# EAGLE schematic W25N01GVZ (EAGLE 7.5.0)
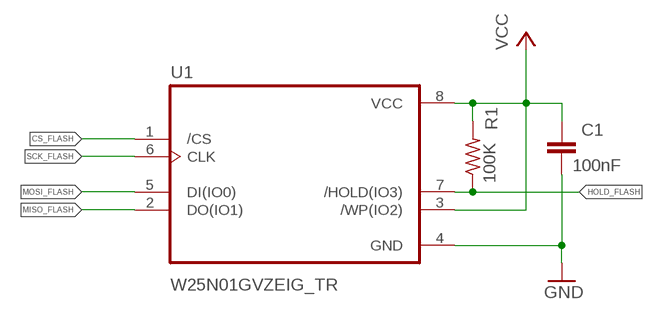
[diagram p0: schematic, sheet 1]

## Parts
C1  100nF  C-EUC0603  [C0603]
R1  100K  R-US_R0603  [R0603]
U1  W25N01GVZEIG_TR  [SON127P800X600X80-9N]

## Nets
CS_FLASH: U1.1(/CS)
GND: C1.2 U1.4(GND)
HOLD_FLASH: R1.1 U1.7(/HOLD(IO3))
MISO_FLASH: U1.2(DO(IO1))
MOSI_FLASH: U1.5(DI(IO0))
SCK_FLASH: U1.6(CLK)
VCC: C1.1 R1.2 U1.3(/WP(IO2)) U1.8(VCC)

## Library data of the parts
C1 = rcl:C-EU: CAPACITOR, European symbol
R1 = rcl:R-US_: RESISTOR, American symbol
U1 = W25N01GVZEIG_TR:W25N01GVZEIG_TR: Ic Flash 1gbit 104mhz 8wson; AVAILABILITY: Unavailable; DESCRIPTION: FLASH - NAND Memory IC 1Gb (128M x 8) SPI 104MHz 8-WSON (8x6); MF: Winbond Electronics; MP: W25N01GVZEIG TR; PACKAGE: WSON-8 Winbond; PRICE: None